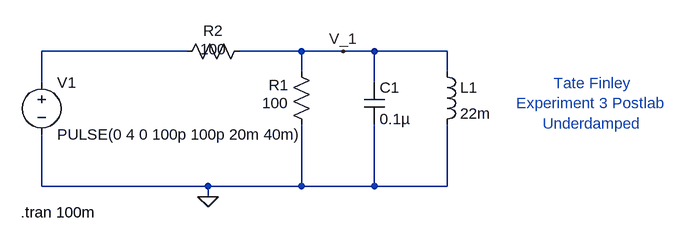
[diagram p0: schematic ECE3060_Experiment3_Postlab_critical.asc]
ECE3060_Experiment3_Postlab_critical.asc, the LTspice schematic file:
Version 4
SHEET 1 952 680
WIRE 96 64 -128 64
WIRE 272 64 176 64
WIRE 336 64 272 64
WIRE 384 64 336 64
WIRE 496 64 384 64
WIRE 272 96 272 64
WIRE 496 96 496 64
WIRE -128 112 -128 64
WIRE 384 112 384 64
WIRE -128 272 -128 192
WIRE 128 272 -128 272
WIRE 272 272 272 176
WIRE 272 272 128 272
WIRE 384 272 384 176
WIRE 384 272 272 272
WIRE 496 272 496 176
WIRE 496 272 384 272
WIRE 128 288 128 272
FLAG 128 288 0
FLAG 336 64 V_1
SYMBOL voltage -128 96 R0
WINDOW 123 0 0 Left 0
WINDOW 39 0 0 Left 0
SYMATTR InstName V1
SYMATTR Value PULSE(0 4 0 100p 100p 20m 40m)
SYMBOL res 288 192 R180
WINDOW 0 36 76 Left 2
WINDOW 3 36 48 Left 2
SYMATTR InstName R1
SYMATTR Value 100
SYMBOL ind 480 80 R0
SYMATTR InstName L1
SYMATTR Value 22m
SYMBOL cap 368 112 R0
SYMATTR InstName C1
SYMATTR Value 0.1µ
SYMBOL res 80 80 R270
WINDOW 0 32 56 VTop 2
WINDOW 3 4 56 VTop 2
SYMATTR InstName R2
SYMATTR Value 100
TEXT 720 144 Center 2 ;Tate Finley\nExperiment 3 Postlab \nUnderdamped
TEXT -160 312 Left 2 !.tran 100m

The netlist it stands for:
* ECE3060_Experiment3_Postlab_critical.asc
V1 N001 0 PULSE(0 4 0 100p 100p 20m 40m)
R1 0 V_1 100
L1 V_1 0 22m
C1 V_1 0 0.1µ
R2 N001 V_1 100
* Tate Finley
* Experiment 3 Postlab
* Underdamped
.tran 100m
.backanno
.end